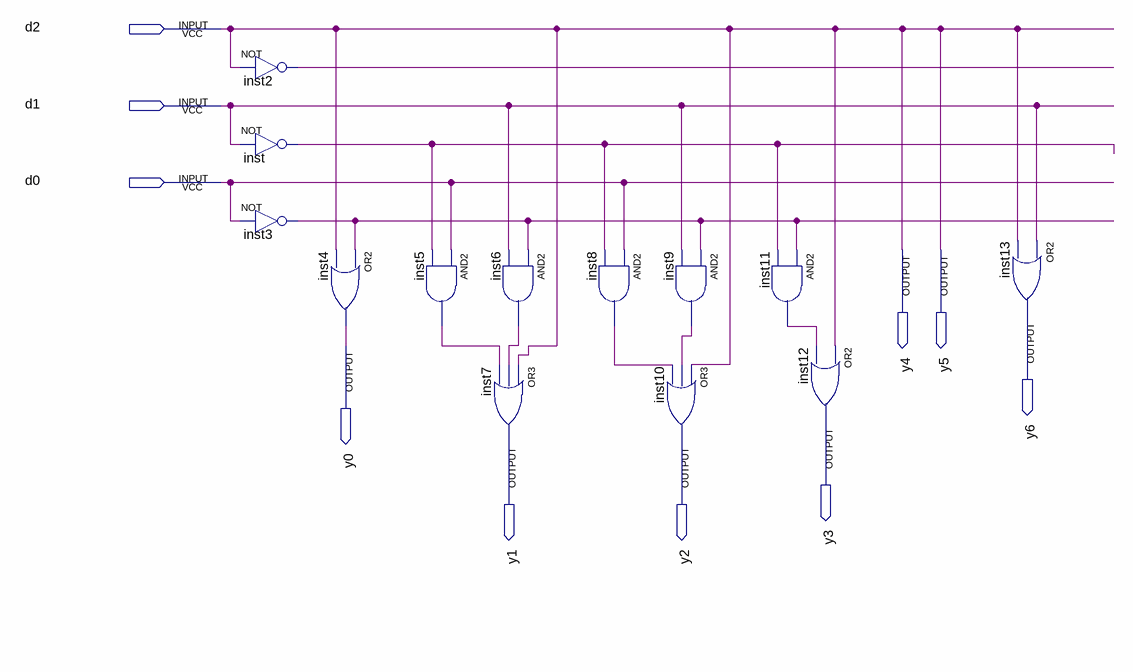
[diagram p0: schematic sheet]
// Quartus schematic 7_seg_dekoder.bdf as structural Verilog: 13 symbols, 10 pins
module \7_seg_dekoder  (
  input  d2,
  input  d1,
  input  d0,
  output y4,
  output y5,
  output y6,
  output y0,
  output y3,
  output y1,
  output y2
);

  wire inst2_out, inst3_out, inst5_out, inst6_out, inst8_out, inst9_out, inst11_out, inst_out;

  not inst2 (inst2_out, d2);
  not inst (inst_out, d1);
  not inst3 (inst3_out, d0);
  or inst4 (y0, inst3_out, d2);
  and inst5 (inst5_out, d0, inst_out);
  and inst6 (inst6_out, inst3_out, d1);
  or inst7 (y1, d2, inst6_out, inst5_out);
  and inst8 (inst8_out, d0, inst_out);
  and inst9 (inst9_out, inst3_out, d1);
  or inst10 (y2, d2, inst9_out, inst8_out);
  and inst11 (inst11_out, inst3_out, inst_out);
  or inst12 (y3, d2, inst11_out);
  or inst13 (y6, d1, d2);

  assign y4 = d2;
  assign y5 = d2;
endmodule
